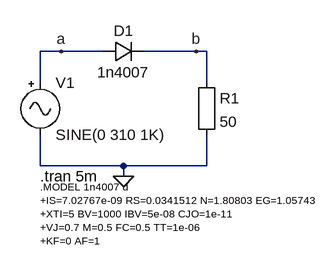
[diagram p0: schematic rectifier_half_vawe_positive.asc]
rectifier_half_vawe_positive.asc, the LTspice schematic file:
Version 4
SHEET 1 880 680
WIRE -176 144 -208 144
WIRE -112 144 -176 144
WIRE 32 144 -48 144
WIRE 48 144 32 144
WIRE -208 192 -208 144
WIRE 48 192 48 144
WIRE -208 320 -208 272
WIRE -80 320 -208 320
WIRE 48 320 48 272
WIRE 48 320 -80 320
WIRE -80 336 -80 320
FLAG -80 336 0
FLAG -176 144 a
FLAG 32 144 b
SYMBOL diode -112 160 R270
WINDOW 0 32 32 VTop 2
WINDOW 3 0 32 VBottom 2
SYMATTR InstName D1
SYMATTR Value 1n4007
SYMBOL Misc\\EuropeanResistor 32 176 R0
SYMATTR InstName R1
SYMATTR Value 50
SYMBOL Misc\\signal -208 176 R0
WINDOW 123 0 0 Left 2
WINDOW 39 0 0 Left 2
SYMATTR InstName V1
SYMATTR Value SINE(0 310 1K)
TEXT -208 336 Left 2 !.tran 5m
TEXT -208 352 Left 1 !.MODEL 1n4007 d\n+IS=7.02767e-09 RS=0.0341512 N=1.80803 EG=1.05743\n+XTI=5 BV=1000 IBV=5e-08 CJO=1e-11\n+VJ=0.7 M=0.5 FC=0.5 TT=1e-06\n+KF=0 AF=1

The netlist it stands for:
* rectifier_half_vawe_positive.asc
D1 a b 1n4007
R1 b 0 50
V1 a 0 SINE(0 310 1K)
.model D D
.lib standard.dio
.tran 5m
.MODEL 1n4007 d
+IS=7.02767e-09 RS=0.0341512 N=1.80803 EG=1.05743
+XTI=5 BV=1000 IBV=5e-08 CJO=1e-11
+VJ=0.7 M=0.5 FC=0.5 TT=1e-06
+KF=0 AF=1
.backanno
.end